# Altium project NeuroPico Hub.PrjPcb (part 1 of 2)
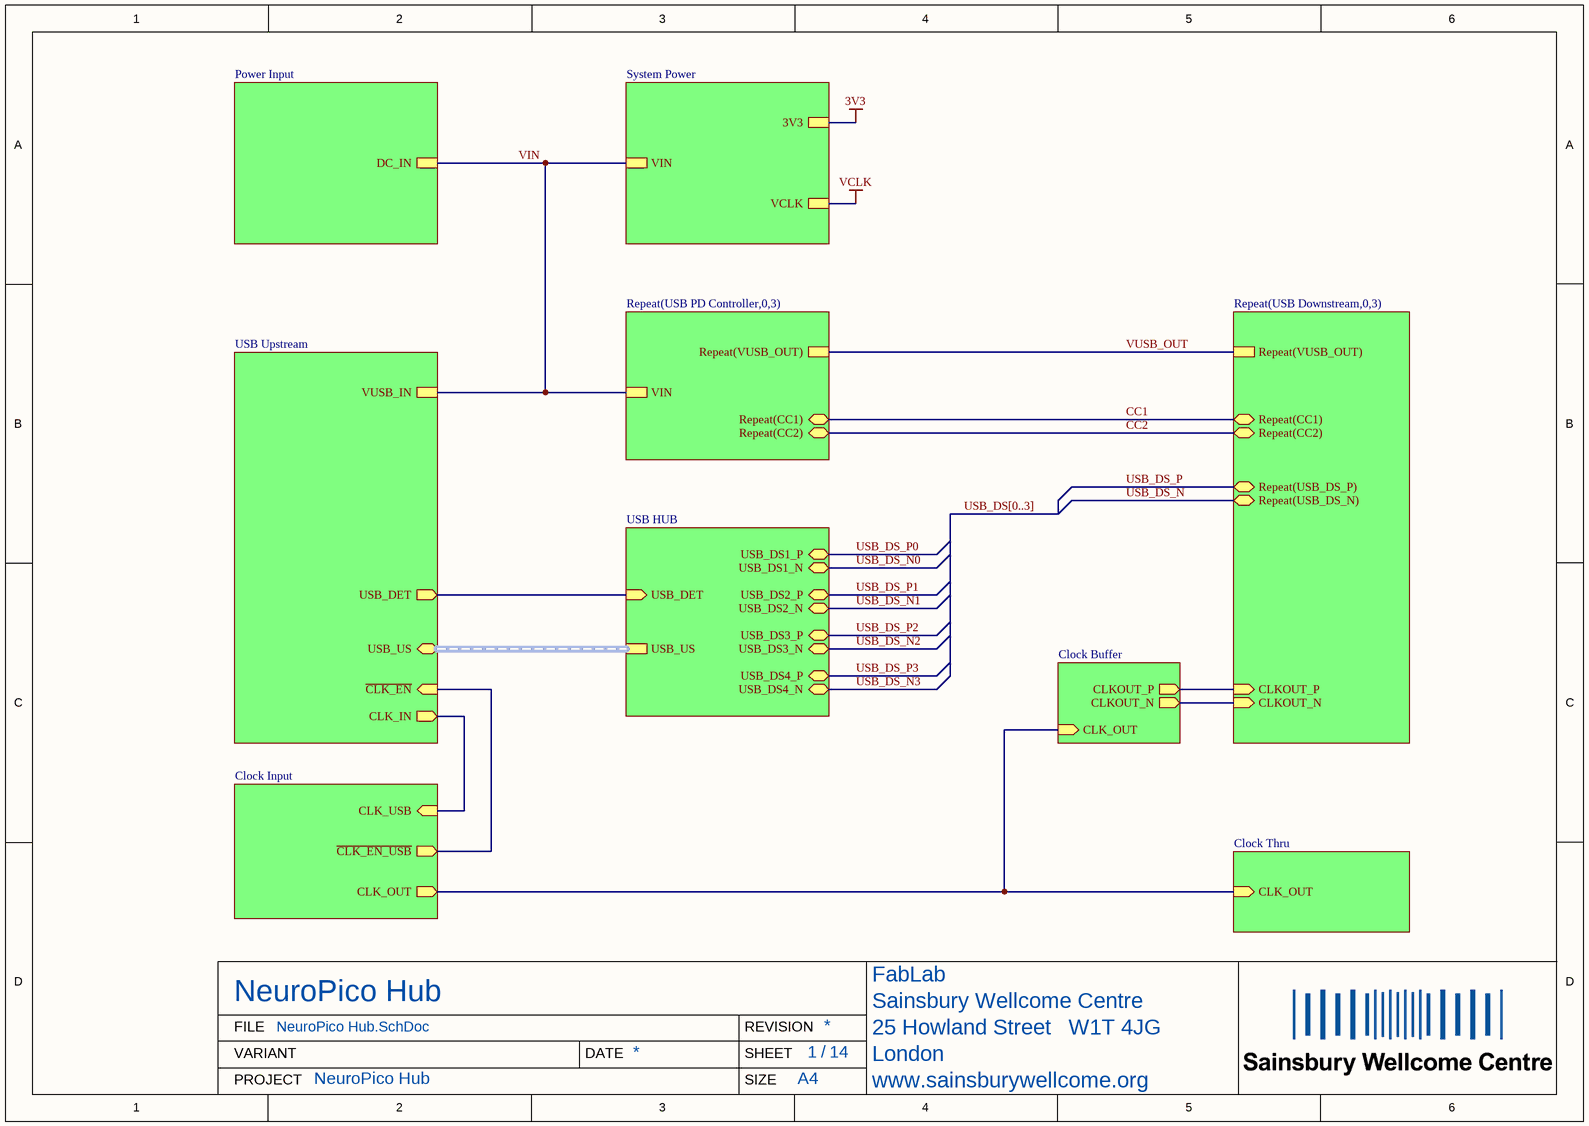
[diagram p0: NeuroPico Hub.SchDoc]
Project: NeuroPico Hub
14 sheets, 397 parts. Net scope: hierarchical (ports join the sheet entries above them; power ports are global).
Board file: NeuroPico Hub.PcbDoc
Sheets:
  NeuroPico Hub.SchDoc
    USB Downstream0 = USB Downstream.SchDoc
    USB Downstream1 = USB Downstream.SchDoc
    USB Downstream2 = USB Downstream.SchDoc
    USB Downstream3 = USB Downstream.SchDoc
    System Power = System Power.SchDoc
    Clock Input = Clock Input.SchDoc
    Power Input = Power Input.SchDoc
    Clock Thru = Clock Thru.SchDoc
    USB Upstream = USB Upstream.SchDoc
      PD Controller Sink = PD Controller Sink.SchDoc
    USB HUB = USB HUB.SchDoc
    USB PD Controller0 = USB PD Controller.SchDoc
      DC SEPIC = DC SEPIC.SchDoc
      PD Controller Source = PD Controller Source.SchDoc
        MOS Switch = MOS Switch.SchDoc
    USB PD Controller1 = USB PD Controller.SchDoc
      DC SEPIC = DC SEPIC.SchDoc
      PD Controller Source = PD Controller Source.SchDoc
        MOS Switch = MOS Switch.SchDoc
    USB PD Controller2 = USB PD Controller.SchDoc
      DC SEPIC = DC SEPIC.SchDoc
      PD Controller Source = PD Controller Source.SchDoc
        MOS Switch = MOS Switch.SchDoc
    USB PD Controller3 = USB PD Controller.SchDoc
      DC SEPIC = DC SEPIC.SchDoc
      PD Controller Source = PD Controller Source.SchDoc
        MOS Switch = MOS Switch.SchDoc
    Clock Buffer = Clock Buffer.SchDoc

## Sheet NeuroPico Hub.SchDoc
size 297 x 209 mm; CompanyName: Sainsbury Wellcome Centre; Organization: FabLab; Address1: Sainsbury Wellcome Centre; Address2: 25 Howland Street; Address3: London; Address4: W1T 4JG; DocumentNumber: 1; SheetNumber: 1; SheetTotal: 14; swcgroup: FabLab; Org: Sainsbury Wellcome Centre; Add1: 25 Howland Street; Add2: London; Add3: W1T 4JG; WebAddress: www.sainsburywellcome.org; SheetSize: A4; SheetName: NeuroPico Hub

### Sub-sheets
Clock Buffer = Clock Buffer.SchDoc: CLK_OUT (in), CLKOUT_P (out), CLKOUT_N (out)
Clock Input = Clock Input.SchDoc: CLK_OUT (out), CLK_USB (in), ~{CLK_EN_USB} (out)
Clock Thru = Clock Thru.SchDoc: CLK_OUT (in)
Power Input = Power Input.SchDoc: DC_IN
Repeat(USB Downstream,0,3) = USB Downstream.SchDoc: CLKOUT_P (in), CLKOUT_N (in), Repeat(USB_DS_P) (bidir), Repeat(USB_DS_N) (bidir), Repeat(CC1) (bidir), Repeat(CC2) (bidir), Repeat(VUSB_OUT)
Repeat(USB PD Controller,0,3) = USB PD Controller.SchDoc: VIN, Repeat(CC1) (bidir), Repeat(CC2) (bidir), Repeat(VUSB_OUT)
System Power = System Power.SchDoc: VIN, 3V3, VCLK
USB HUB = USB HUB.SchDoc: USB_DS1_N (bidir), USB_DS1_P (bidir), USB_DS2_N (bidir), USB_DS2_P (bidir), USB_DS3_P (bidir), USB_DS3_N (bidir), USB_US (harness USB_US), USB_DS4_P (bidir), USB_DS4_N (bidir), USB_DET (in)
USB Upstream = USB Upstream.SchDoc: USB_US (bidir, harness USB_US), VUSB_IN, CLK_IN (out), ~{CLK_EN} (in), USB_DET (out)

### Nets
CC1: sheet Repeat(USB Downstream,0,3)/Repeat(CC1), sheet Repeat(USB PD Controller,0,3)/Repeat(CC1)
CC2: sheet Repeat(USB Downstream,0,3)/Repeat(CC2), sheet Repeat(USB PD Controller,0,3)/Repeat(CC2)
CLK_OUT: sheet Clock Input/CLK_OUT, sheet Clock Thru/CLK_OUT, sheet Clock Buffer/CLK_OUT
CLK_USB: sheet Clock Input/CLK_USB, sheet USB Upstream/CLK_IN
CLKOUT_N: sheet Repeat(USB Downstream,0,3)/CLKOUT_N, sheet Clock Buffer/CLKOUT_N
CLKOUT_P: sheet Repeat(USB Downstream,0,3)/CLKOUT_P, sheet Clock Buffer/CLKOUT_P
USB_DS_N: sheet Repeat(USB Downstream,0,3)/Repeat(USB_DS_N)
USB_DS_P: sheet Repeat(USB Downstream,0,3)/Repeat(USB_DS_P)
VIN: sheet System Power/VIN, sheet Power Input/DC_IN, sheet USB Upstream/VUSB_IN, sheet Repeat(USB PD Controller,0,3)/VIN
VUSB_OUT: sheet Repeat(USB Downstream,0,3)/Repeat(VUSB_OUT), sheet Repeat(USB PD Controller,0,3)/Repeat(VUSB_OUT)
NetQ1_3: sheet Clock Input/~{CLK_EN_USB}, sheet USB Upstream/~{CLK_EN}
NetQ3_3: sheet USB Upstream/USB_DET, sheet USB HUB/USB_DET

### Buses and harness runs
bus USB_DS[0..3]
harness sheet USB HUB/USB_US = sheet USB Upstream/USB_US

### Notes on the sheet
- FILE
- VARIANT
- DATE
- REVISION
- SHEET
- /
- PROJECT
- SIZE

## Sheet USB Downstream.SchDoc
size 297 x 209 mm; CompanyName: Sainsbury Wellcome Centre; Organization: FabLab; Address1: Sainsbury Wellcome Centre; Address2: 25 Howland Street; Address3: London; Address4: W1T 4JG; DocumentNumber: 11; SheetNumber: 11; SheetTotal: 14; swcgroup: FabLab; Org: Sainsbury Wellcome Centre; Add1: 25 Howland Street; Add2: London; Add3: W1T 4JG; WebAddress: www.sainsburywellcome.org; SheetSize: A4; SheetName: USB Downstream
Used 4 times, as channels USB Downstream0, USB Downstream1, USB Downstream2, USB Downstream3. Parts and nets are listed once, with the designators drawn on the sheet.
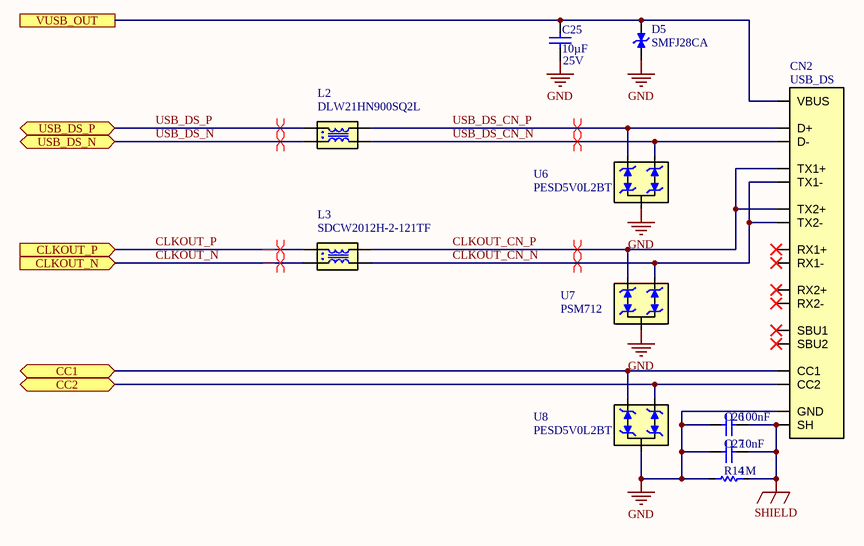
[diagram p1: USB Downstream.SchDoc]

### Parts
C25  value 10µF  Voltage Rating: 25V  [CAP_CHIP_0603]  (hidden comment: C0603-10uF-25V)
C26  value 100nF  [CAP_CHIP_0603]  (hidden comment: C0603-100nF-50V)
C27  value 10nF  [CAP_CHIP_0603]  (hidden comment: C0603-10nF-50V)
CN2  USB_DS  [TYPEC-24P]
D5  SMFJ28CA  [SOD123]
L2  PartNumber: DLW21HN900SQ2L  [IND_CHOKE_0805]  (hidden comment: CHOKE-90R)
L3  PartNumber: SDCW2012H-2-121TF  [IND_CHOKE_0805]  (hidden comment: CHOKE-120R)
R14  value 1M  [RES_CHIP_0603]  (hidden comment: R0603-1M)
U6  PESD5V0L2BT  [SOT23]
U7  PSM712  [SOT23]
U8  PESD5V0L2BT  [SOT23]

### Ports
CC1 (bidir), CC2 (bidir), CLKOUT_N (in), CLKOUT_P (in), USB_DS_N (bidir), USB_DS_P (bidir), VUSB_OUT

### Nets
GND: C25.1 C26.2 C27.2 CN2.A1,_A12,_B1,_B12(GND) D5.1(K) R14.2 U6.3(COM) U7.3(COM) U8.3(COM)
SHIELD: C26.1 C27.1 CN2.0(SH) R14.1
CC1: CN2.A5(CC1) U8.1(ANODE) ; port CC1
CC2: CN2.B5(CC2) U8.2(ANODE) ; port CC2
CLKOUT_CN_N: CN2.A3(TX1-) CN2.B3(TX2-) L3.3 U7.1(ANODE)
CLKOUT_CN_P: CN2.A2(TX1+) CN2.B2(TX2+) L3.2 U7.2(ANODE)
CLKOUT_N: L3.4 ; port CLKOUT_N
CLKOUT_P: L3.1 ; port CLKOUT_P
USB_DS_CN_N: CN2.A7,_B7(D-) L2.3 U6.1(ANODE)
USB_DS_CN_P: CN2.A6,_B6(D+) L2.2 U6.2(ANODE)
USB_DS_N: L2.4 ; port USB_DS_N
USB_DS_P: L2.1 ; port USB_DS_P
VUSB_OUT: C25.2 CN2.A4,_A9,_B4,_B9(VBUS) D5.2(A) ; port VUSB_OUT

Not connected (* = marked no-connect by the designer): CN2 A8(SBU1)* A10(RX2-)* A11(RX2+)* B8(SBU2)* B10(RX1-)* B11(RX1+)*

### Channels
USB Downstream0: designators end in A; ports CC1=CC10 CC2=CC20 CLKOUT_N=CLKOUT_N CLKOUT_P=CLKOUT_P USB_DS_N=USB_DS1_N USB_DS_P=USB_DS1_P VUSB_OUT=VUSB_OUT0
USB Downstream1: designators end in B; ports CC1=CC11 CC2=CC21 CLKOUT_N=CLKOUT_N CLKOUT_P=CLKOUT_P USB_DS_N=USB_DS2_N USB_DS_P=USB_DS2_P VUSB_OUT=VUSB_OUT1
USB Downstream2: designators end in C; ports CC1=CC12 CC2=CC22 CLKOUT_N=CLKOUT_N CLKOUT_P=CLKOUT_P USB_DS_N=USB_DS3_N USB_DS_P=USB_DS3_P VUSB_OUT=VUSB_OUT2
USB Downstream3: designators end in D; ports CC1=CC13 CC2=CC23 CLKOUT_N=CLKOUT_N CLKOUT_P=CLKOUT_P USB_DS_N=USB_DS4_N USB_DS_P=USB_DS4_P VUSB_OUT=VUSB_OUT3

### Layout directives
differential pair; differential pair class USB: USB_DS1_N, USB_DS1_P, USB_DS_CN_N_USB Downstream0, USB_DS_CN_P_USB Downstream0
differential pair; differential pair class RS485: CLKOUT_CN_N_USB Downstream0, CLKOUT_CN_P_USB Downstream0, CLKOUT_N, CLKOUT_P

### Notes on the sheet
- FILE
- VARIANT
- DATE
- REVISION
- SHEET
- /
- PROJECT
- SIZE

### Library data of the parts
C25 = CMP-611-0050-6: 0603 Multilayer Ceramic Capacitors MLCC; PartNumber: CL10A106MA8NRNC; Dielectric: X5R; Pick&PlaceFootprint: C0603; Tolerance: 20%; Case/Package: 0603; LCSC Part N.: C96446; RoHS: Yes; Capacitor Type: Ceramic; Mount: SMD
C26 = CMP-611-0027-24: 0603 Multilayer Ceramic Capacitors MLCC; PartNumber: CC0603KRX7R9BB104; Voltage Rating: 50V; Pick&PlaceFootprint: C0603; Dielectric: X7R; Tolerance: 10%; LCSC Part N.: C14663; Capacitor Type: Ceramic; Case/Package: 0603; RoHS: Yes; Mount: SMD
C27 = CMP-611-0022-7: 0603 Multilayer Ceramic Capacitors MLCC; PartNumber: 0603B103K500NT; Tolerance: 10%; Voltage Rating: 50V; Dielectric: X7R; Pick&PlaceFootprint: C0603; Capacitor Type: Ceramic; Mount: SMD; Case/Package: 0603; LCSC Part N.: C57112; RoHS: Yes
CN2 = CMP-340-0003-10: USB 3.1 5A 1 260℃ Surface Mount，Right Angle 24P Female -45℃~+85℃ Type-C SMD USB Connectors; pin to pad: S1>G1+G2+G3+G4+G5+G6; PartNumber: TYPEC-324G-BCP24; Current Rating: 5A; Mount: Surface Mount; LCSC Part N.: C920230; Orientation: Horizontal; Gender: Female
D5 = CMP-210-0002-1: 4.4A 45.4V@4.4A 200W 31.1V Bi-Directional 28V SOD-123F Electrostatic and Surge Protection (TVS/ESD); Breakdown Voltage: 31V; Clamp Voltage: 45.4V; PartNumber: SMFJ28CA; Stand-off Voltage: 28V; Pick&PlaceFootprint: SOD-123; Mount: Surface Mount; LCSC Part N.: C5125651
L2 = CMP-600-0002-3: Data Line Filter, 2 Function(s), 50V, 0.33A, 4 Pin(s); DC Resistance-Max: 350mR; Insulation Resistance-Min: 10MR; Current Rating: 330mA; Output Impedance: 90R; Channels: 2; LCSC Part N.: C80529; Voltage Rating: 50V
L3 = CMP-600-0007-1: Data Line Filter, 2 Function(s), 20V, 0.28A, 4 Pin(s); Output Impedance: 120R; Current Rating: 280mA; DC Resistance-Max: 400mR; Insulation Resistance-Min: 10kR; Channels: 2; LCSC Part N.: C370248; Voltage Rating: 20V
R14 = CMP-633-0066-20: 100mW Thick Film Resistors 75V ±100ppm/℃ ±1% 0603 Chip Resistor; PartNumber: 0603WAF1004T5E; Pick&PlaceFootprint: R0603; Number of Resistors: 1; Mount: Surface Mount; Case/Package: 0603; Voltage Rating: 75V; LCSC Part N.: C22935; Power Rating: 100mW; Tolerance: 1%
U6 U8 = CMP-210-0005-2: Low capacitance double bidirectional ESD protection diodes in SOT23; Pick&PlaceFootprint: SOT-23; Stand-off Voltage: 5V; Breakdown Voltage: 7.5V; Clamp Voltage: 10V; PartNumber: PESD5V0L2BT; LCSC Part N.: C2858724
U7 = CMP-210-0000-4: 19V 13.3V 12V SOT-23 Electrostatic and Surge Protection (TVS/ESD); PartNumber: PSM712-LF-T7; LCSC Part N.: C32677; Stand-off Voltage: 12V; Pick&PlaceFootprint: SOT-23; Breakdown Voltage: 13.3V; Clamp Voltage: 19V; Mount: Surface Mount

## Sheet System Power.SchDoc
size 297 x 209 mm; CompanyName: Sainsbury Wellcome Centre; Organization: FabLab; Address1: Sainsbury Wellcome Centre; Address2: 25 Howland Street; Address3: London; Address4: W1T 4JG; DocumentNumber: 3; SheetNumber: 3; SheetTotal: 14; swcgroup: FabLab; Org: Sainsbury Wellcome Centre; Add1: 25 Howland Street; Add2: London; Add3: W1T 4JG; WebAddress: www.sainsburywellcome.org; SheetSize: A4; SheetName: System Power
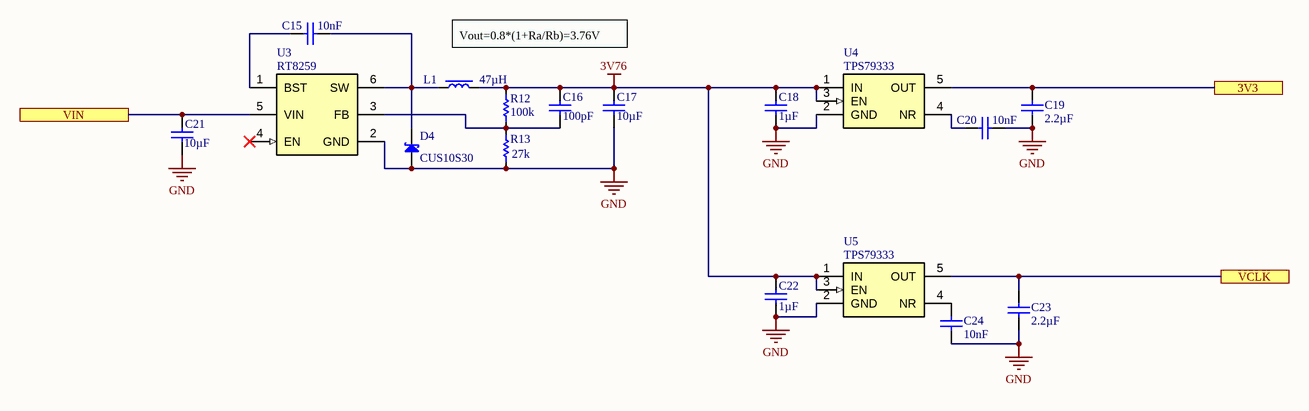
[diagram p2: System Power.SchDoc]

### Parts
C15  value 10nF  [CAP_CHIP_0603]  (hidden comment: C0603-10nF-50V)
C16  value 100pF  [CAP_CHIP_0603]  (hidden comment: C0603-100pF-50V)
C17  value 10µF  [CAP_CHIP_0603]  (hidden comment: C0603-10uF-35V)
C18  value 1µF  [CAP_CHIP_0603]  (hidden comment: C0603-1uF-50V)
C19  value 2.2µF  [CAP_CHIP_0603]  (hidden comment: C0603-2.2uF-50V)
C20  value 10nF  [CAP_CHIP_0603]  (hidden comment: C0603-10nF-100V)
C21  value 10µF  [CAP_CHIP_0603]  (hidden comment: C0603-10uF-35V)
C22  value 1µF  [CAP_CHIP_0603]  (hidden comment: C0603-1uF-50V)
C23  value 2.2µF  [CAP_CHIP_0603]  (hidden comment: C0603-2.2uF-50V)
C24  value 10nF  [CAP_CHIP_0603]  (hidden comment: C0603-10nF-100V)
D4  CUS10S30  [SOD323]
L1  value 47µH  [IND_PWR_1210]  (hidden comment: L-PWR-47uH-0.3A)
R12  value 100k  [RES_CHIP_0603]  (hidden comment: R0603-100K)
R13  value 27k  [RES_CHIP_0603]  (hidden comment: R0603-27K)
U3  RT8259  [SOT23-6]
U4  TPS79333  [SOT23-5]
U5  TPS79333  [SOT23-5]

### Ports
3V3, VCLK, VIN

### Nets
3V3: C19.2 U4.5(OUT) ; port 3V3
3V76: C16.2 C17.2 C18.2 C22.2 L1.2 R12.2 U4.1(IN) U4.3(EN) U5.1(IN) U5.3(EN)
GND: C17.1 C18.1 C19.1 C20.1 C21.1 C22.1 C23.1 C24.1 D4.2(A) R13.1 U3.2(GND) U4.2(GND) U5.2(GND)
VCLK: C23.2 U5.5(OUT) ; port VCLK
VIN: C21.2 U3.5(VIN) ; port VIN
NetC15_1: C15.1 D4.1(C) L1.1 U3.6(SW)
NetC15_2: C15.2 U3.1(BST)
NetC16_1: C16.1 R12.1 R13.2 U3.3(FB)
NetC20_2: C20.2 U4.4(NR)
NetC24_2: C24.2 U5.4(NR)

Not connected (* = marked no-connect by the designer): U3 4(EN)*

### Notes on the sheet
- Vout=0.8*(1+Ra/Rb)=3.76V
- FILE
- VARIANT
- DATE
- REVISION
- SHEET
- /
- PROJECT
- SIZE

### Library data of the parts
C15 = CMP-611-0022-7: 0603 Multilayer Ceramic Capacitors MLCC; PartNumber: 0603B103K500NT; Tolerance: 10%; Voltage Rating: 50V; Pick&PlaceFootprint: C0603; Dielectric: X7R; RoHS: Yes; Capacitor Type: Ceramic; Mount: SMD; Case/Package: 0603; LCSC Part N.: C57112
C16 = CMP-611-0038-6: 0603 Multilayer Ceramic Capacitors MLCC; PartNumber: CL10C101JB8NNNC; Pick&PlaceFootprint: C0603; Tolerance: 5%; Voltage Rating: 50V; Dielectric: C0G; Case/Package: 0603; LCSC Part N.: C14858; Capacitor Type: Ceramic; Mount: SMD; RoHS: Yes
C17 C21 = CMP-611-0048-3: Ceramic Capacitor, Multilayer, Ceramic, 35V, 20% +Tol, 20% -Tol, X5R, 15% TC, 10uF, Surface Mount, 0603; PartNumber: GRM188R6YA106MA73D; Pick&PlaceFootprint: C0603; Dielectric: X5R; Capacitor Type: Ceramic; Mount: SMD; LCSC Part N.: C194427; RoHS: Yes; Tolerance: 20%; Voltage Rating: 35V; Case/Package: 0603
C18 C22 = CMP-611-0033-11: 0603 Multilayer Ceramic Capacitors MLCC; PartNumber: CL10A105KB8NNNC; Pick&PlaceFootprint: C0603; Voltage Rating: 50V; Dielectric: X5R; Tolerance: 10%; Case/Package: 0603; LCSC Part N.: C15849; RoHS: Yes; Mount: SMD; Capacitor Type: Ceramic
C19 C23 = CMP-611-0060-3: 0603 Multilayer Ceramic Capacitors MLCC; PartNumber: GRM188R61H225KE11D; Pick&PlaceFootprint: C0603; Voltage Rating: 50V; Dielectric: X5R; Tolerance: 10%; Mount: SMD; LCSC Part N.: C162273; Capacitor Type: Ceramic; Case/Package: 0603; RoHS: Yes
C20 C24 = CMP-611-0030-11: 0603 Multilayer Ceramic Capacitors MLCC; PartNumber: CL10B103KC84PEL; Tolerance: 10%; Voltage Rating: 100V; Dielectric: X7R; Pick&PlaceFootprint: C0603; LCSC Part N.: C525730; Case/Package: 0603; Capacitor Type: Ceramic; Mount: SMD; RoHS: Yes
D4 = CMP-821-0013-3: Rectifier Diode, Schottky, 1 Phase, 1 Element, 1A, 30V V(RRM), Silicon; PartNumber: CUS10S30,H3F; Forward Voltage: 370mV; LCSC Part N.: C146335; Max Reverse Voltage: 30V; Mount: Surface Mount; Pick&PlaceFootprint: SOD323; Forward Current: 1A
L1 = CMP-620-0005-6: Inductor Power Chip Shielded Wirewound 47uH 20% 1MHz Ferrite 0.5A 0.9Ohm DCR 1210 Automotive T/R; PartNumber: LQW32FT470M0HL; RMS Current (Irms): 500mA; Saturation Current: 300mA; DC Resistance (DCR): 900mR; Tolerance: 20%; LCSC Part N.: C907956
R12 = CMP-633-0000-28: 100mW Thick Film Resistors 75V ±100ppm/℃ ±1% 0603 Chip Resistor; PartNumber: 0603WAF1003T5E; Number of Resistors: 1; Pick&PlaceFootprint: R0603; LCSC Part N.: C25803; Mount: Surface Mount; Voltage Rating: 75V; Power Rating: 100mW; Case/Package: 0603; Tolerance: 1%
R13 = CMP-633-0124-2: 100mW Thick Film Resistors 75V ±100ppm/℃ ±1% 0603 Chip Resistor; PartNumber: 0603WAF2702T5E; Pick&PlaceFootprint: R0603; Number of Resistors: 1; Tolerance: 1%; Case/Package: 0603; Mount: Surface Mount; Voltage Rating: 75V; Power Rating: 100mW; LCSC Part N.: C22967
U3 = CMP-970-0044-2: Step-down type Adjustable 800mV~15V 1.2A 4.5V~24V Switching Regulator/Controller; PartNumber: RT8259GJ6; Min Input Voltage: 4.5V; RDS(On): 300mR; Reference Voltage: 0.8V; Switcher Configuration: BUCK; Switching Frequency: 1.4MHz; Max Input Voltage: 24V; Max Output Voltage: 15V; LCSC Part N.: C425775; Pick&PlaceFootprint: SOT23-6; Max Output current: 1.2A
U4 U5 = CMP-970-0017-6: LDO Regulator Pos 3.3V 0.2A 5-Pin SOT-23-5 200mA; PartNumber: TPS79333DBVR; Max Input Voltage: 5.5V; Dropout Voltage: 102mV; Line Regulation: 0.05%; Quiescent Current: 170uA; PSRR: 70dB; Output Noise: 32uV; Accuracy: 2%; Output Type: Fixed; Load Regulation: 0.03%; LCSC Part N.: C9840; Pick&PlaceFootprint: SOT23-5; Output Voltage: 3.3V; Max Output Current: 200mA

## Sheet Clock Input.SchDoc
size 297 x 209 mm; CompanyName: Sainsbury Wellcome Centre; Organization: FabLab; Address1: Sainsbury Wellcome Centre; Address2: 25 Howland Street; Address3: London; Address4: W1T 4JG; DocumentNumber: 12; SheetNumber: 12; SheetTotal: 14; swcgroup: FabLab; Org: Sainsbury Wellcome Centre; Add1: 25 Howland Street; Add2: London; Add3: W1T 4JG; WebAddress: www.sainsburywellcome.org; SheetSize: A4; SheetName: Clock Input
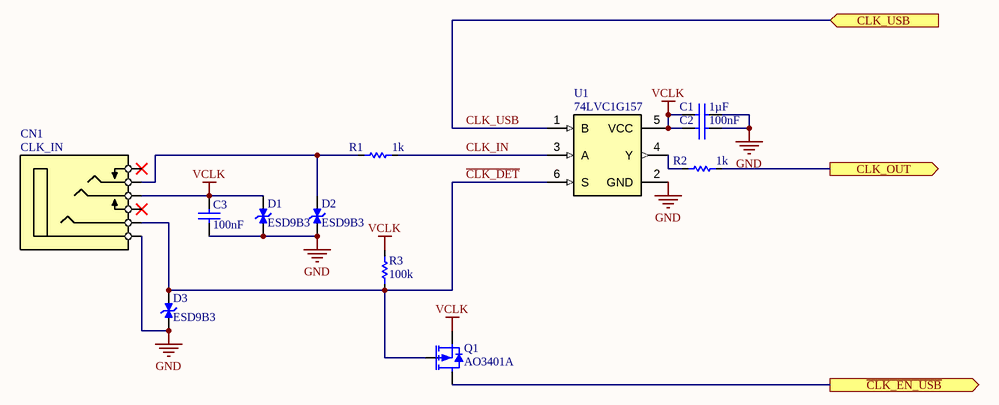
[diagram p3: Clock Input.SchDoc]

### Parts
C1  value 1µF  [CAP_CHIP_0603]  (hidden comment: C0603-1uF-50V)
C2  value 100nF  [CAP_CHIP_0603]  (hidden comment: C0603-100nF-50V)
C3  value 100nF  [CAP_CHIP_0603]  (hidden comment: C0603-100nF-50V)
CN1  CLK_IN  [PJ-316A]
D1  ESD9B3  [SOD923]
D2  ESD9B3  [SOD923]
D3  ESD9B3  [SOD923]
Q1  AO3401A  [SOT23]
R1  value 1k  [RES_CHIP_0603]  (hidden comment: R0603-1K)
R2  value 1k  [RES_CHIP_0603]  (hidden comment: R0603-1K)
R3  value 100k  [RES_CHIP_0603]  (hidden comment: R0603-100K)
U1  74LVC1G157  [SOT363]

### Ports
CLK_OUT (out), CLK_USB (in), ~{CLK_EN_USB} (out)

### Nets
GND: C1.1 C2.1 C3.1 CN1.1(S) D1.1(K) D2.1(K) D3.1(K) U1.2(GND)
VCLK: C1.2 C2.2 C3.2 CN1.3(R) D1.2(A) Q1.2(S) R3.2 U1.5(VCC)
~{CLK_DET}: CN1.4(RR) D3.2(A) Q1.1(G) R3.1 U1.6(S)
CLK_IN: R1.1 U1.3(A)
CLK_OUT: R2.1 ; port CLK_OUT
CLK_USB: U1.1(B) ; port CLK_USB
NetCN1_2: CN1.2(T) D2.2(A) R1.2
NetQ1_3: Q1.3(D) ; port ~{CLK_EN_USB}
NetR2_2: R2.2 U1.4(Y)

Not connected (* = marked no-connect by the designer): CN1 5(TS)* 6(RS)*

### Notes on the sheet
- FILE
- VARIANT
- DATE
- REVISION
- SHEET
- /
- PROJECT
- SIZE

### Library data of the parts
C1 = CMP-611-0033-11: as C18 on sheet System Power; Case/Package: 0603; LCSC Part N.: C15849; RoHS: Yes; Mount: SMD; Capacitor Type: Ceramic
C2 = CMP-611-0027-24: 0603 Multilayer Ceramic Capacitors MLCC; PartNumber: CC0603KRX7R9BB104; Tolerance: 10%; Pick&PlaceFootprint: C0603; Dielectric: X7R; Voltage Rating: 50V; Capacitor Type: Ceramic; RoHS: Yes; Mount: SMD; LCSC Part N.: C14663; Case/Package: 0603
C3 = CMP-611-0027-24: as C26 on sheet USB Downstream; LCSC Part N.: C14663; Capacitor Type: Ceramic; Case/Package: 0603; RoHS: Yes; Mount: SMD
CN1 = CMP-380-0019-5: 3.5mm headphone jack 235℃ 30V 500mA SMD Audio Connector; PartNumber: PJ-316A-6A; Gender: Female; IEC Conformance: No; Mount: Through Hole; LCSC Part N.: C128987; Orientation: Horizontal; Pitch: 3.5mm
D1-D3 = CMP-210-0004-2: ESD9B3.3ST5G, Bi-Directional TVS Diode, 300mW, 2-Pin SOD-923; Stand-off Voltage: 3.3V; Pick&PlaceFootprint: SOT-23; Breakdown Voltage: 5V; Clamp Voltage: 11.5V; LCSC Part N.: C96512; PartNumber: ESD9B3.3ST5G
Q1 = CMP-810-0003-2: 30V 4A 44mΩ@10V,4.3A 1.4W 1.3V@250uA 1 PChannel SOT-23-3L MOSFETs; RDS(ON): 44mR; Gate-Source Voltage (Vgs): 12V; Pick&PlaceFootprint: SOT-23; Drain Current (Id): -4A; Switching Time: 60ns; Drain-Source Voltage (Vds): -30V; Polarity: P Channel; Power Dissipation: 1.4W; LCSC Part N.: C15127; Mount: Surface Mount; PartNumber: AO3401A
R1 R2 = CMP-633-0013-26: 100mW Thick Film Resistors 75V ±100ppm/℃ ±1% 0603 Chip Resistor; PartNumber: 0603WAF1001T5E; Pick&PlaceFootprint: R0603; Number of Resistors: 1; Voltage Rating: 75V; Mount: Surface Mount; Case/Package: 0603; LCSC Part N.: C21190; Tolerance: 1%; Power Rating: 100mW
R3 = CMP-633-0000-28: as R12 on sheet System Power; LCSC Part N.: C25803; Mount: Surface Mount; Voltage Rating: 75V; Power Rating: 100mW; Case/Package: 0603; Tolerance: 1%
U1 = CMP-9A0-0002-3: Encoders, Decoders, Multiplexers & Demultiplexers 74LVC1G157GV-Q100/SC-74/REEL 7; Min Supply Voltage: 1.65V; Max Supply Voltage: 5.5V; Max Output current: 32mA; LCSC Part N.: C135822; PartNumber: 74LVC1G157GV

## Sheet Power Input.SchDoc
size 297 x 209 mm; CompanyName: Sainsbury Wellcome Centre; Organization: FabLab; Address1: Sainsbury Wellcome Centre; Address2: 25 Howland Street; Address3: London; Address4: W1T 4JG; DocumentNumber: 2; SheetNumber: 2; SheetTotal: 14; swcgroup: FabLab; Org: Sainsbury Wellcome Centre; Add1: 25 Howland Street; Add2: London; Add3: W1T 4JG; WebAddress: www.sainsburywellcome.org; SheetSize: A4; SheetName: Power Input
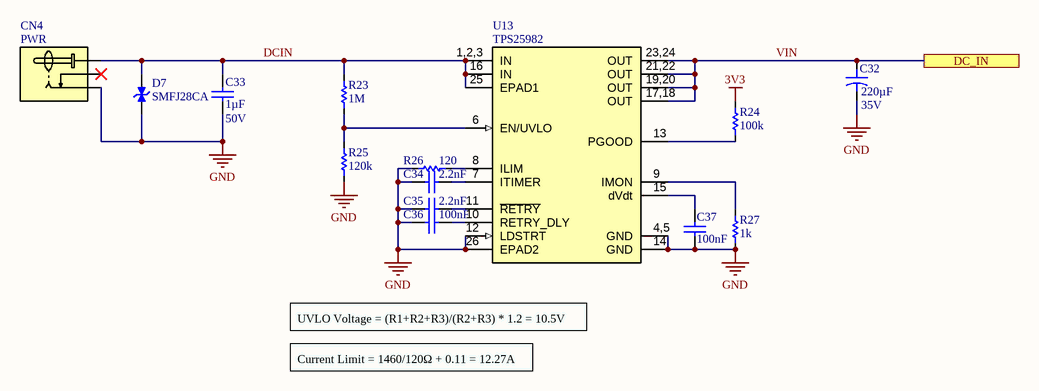
[diagram p4: Power Input.SchDoc]

### Parts
C32  value 220µF  Voltage Rating: 35V  [ECAP_SMD_D8_10.2L]  (hidden comment: SC8-220uF-35V)
C33  value 1µF  Voltage Rating: 50V  [CAP_CHIP_0603]  (hidden comment: C0603-1uF-50V)
C34  value 2.2nF  [CAP_CHIP_0603]  (hidden comment: C0603-2.2nF-50V)
C35  value 2.2nF  [CAP_CHIP_0603]  (hidden comment: C0603-2.2nF-50V)
C36  value 100nF  [CAP_CHIP_0603]  (hidden comment: C0603-100nF-50V)
C37  value 100nF  [CAP_CHIP_0603]  (hidden comment: C0603-100nF-50V)
CN4  PWR  [DC-005-2.0]
D7  SMFJ28CA  [SOD123]
R23  value 1M  [RES_CHIP_0603]  (hidden comment: R0603-1M)
R24  value 100k  [RES_CHIP_0603]  (hidden comment: R0603-100K)
R25  value 120k  [RES_CHIP_0603]  (hidden comment: R0603-120K)
R26  value 120  [RES_CHIP_0603]  (hidden comment: R0603-120R)
R27  value 1k  [RES_CHIP_0603]  (hidden comment: R0603-1K)
U13  TPS25982  [VQFN24]

### Ports
DC_IN

### Nets
3V3: R24.2
GND: C32.2 C33.1 C34.2 C35.2 C36.2 C37.1 CN4.2(Ring) D7.1(K) R25.1 R26.2 R27.1 U13.4,5(GND) U13.12(LDSTRT) U13.14(GND) U13.26(EPAD2)
DCIN: C33.2 CN4.1(Center) D7.2(A) R23.2 U13.1,2,3(IN) U13.16(IN) U13.25(EPAD1)
VIN: C32.1 U13.17,18(OUT) U13.19,20(OUT) U13.21,22(OUT) U13.23,24(OUT) ; port DC_IN
NetC34_1: C34.1 U13.7(ITIMER)
NetC35_1: C35.1 U13.11(~{RETRY})
NetC36_1: C36.1 U13.10(RETRY_DLY)
NetC37_2: C37.2 U13.15(dVdt)
NetR23_1: R23.1 R25.2 U13.6(EN/UVLO)
NetR24_1: R24.1 U13.13(PGOOD)
NetR26_1: R26.1 U13.8(ILIM)
NetR27_2: R27.2 U13.9(IMON)

Not connected (* = marked no-connect by the designer): CN4 3(Detect)*

### Notes on the sheet
- UVLO Voltage = (R1+R2+R3)/(R2+R3) * 1.2 = 10.5V
- Current Limit = 1460/120Ω + 0.11 = 12.27A
- FILE
- VARIANT
- DATE
- REVISION
- SHEET
- /
- PROJECT
- SIZE

### Library data of the parts
C32 = CMP-612-0005-5: Cap Aluminum Polymer 220uF 35V 20% Cylindrical 27m Ohm 2000mA 4000 hr 125°C Emboss T/R; PartNumber: EEHZK1V221UP; Pick&PlaceFootprint: EC8; ESR (Equivalent Series Resistance): 17mR; Capacitor Type: Solid; Ripple Current: 2A; LCSC Part N.: C454287; Mount: Surface Mount; Height: 10.5mm; Tolerance: 20%
C33 = CMP-611-0033-11: 0603 Multilayer Ceramic Capacitors MLCC; PartNumber: CL10A105KB8NNNC; Pick&PlaceFootprint: C0603; Dielectric: X5R; Tolerance: 10%; Case/Package: 0603; LCSC Part N.: C15849; RoHS: Yes; Mount: SMD; Capacitor Type: Ceramic
C34 C35 = CMP-611-0074-1: 0603 Multilayer Ceramic Capacitors MLCC; PartNumber: 0603B222K500NT; Voltage Rating: 50V; Pick&PlaceFootprint: C0603; Tolerance: 10%; Dielectric: X7R; Case/Package: 0603; RoHS: Yes; Mount: SMD; Capacitor Type: Ceramic; LCSC Part N.: C1604
C36 C37 = CMP-611-0027-24: as C2 on sheet Clock Input; Capacitor Type: Ceramic; RoHS: Yes; Mount: SMD; LCSC Part N.: C14663; Case/Package: 0603
CN4 = CMP-360-0005-6: Surface Mount, Right Angle 2.5A 24V SMD DC Power Connector; PartNumber: DC-005-2.5A-2.0-SMT; Connector Type: Jack,Power; Pitch: 2.0mm; Gender: Male; Contact Plating: Tin; Voltage Rating: 24V; Contact Material: Copper Alloy; Current Rating: 2.5A; Mount: Surface Mount; LCSC Part N.: C2880543; Orientation: Horizontal
D7 = CMP-210-0002-1: as D5 on sheet USB Downstream; PartNumber: SMFJ28CA; Stand-off Voltage: 28V; Pick&PlaceFootprint: SOD-123; Mount: Surface Mount; LCSC Part N.: C5125651
R23 = CMP-633-0066-20: 100mW Thick Film Resistors 75V ±100ppm/℃ ±1% 0603 Chip Resistor; PartNumber: 0603WAF1004T5E; Number of Resistors: 1; Pick&PlaceFootprint: R0603; Voltage Rating: 75V; Mount: Surface Mount; LCSC Part N.: C22935; Power Rating: 100mW; Tolerance: 1%; Case/Package: 0603
R24 = CMP-633-0000-28: as R12 on sheet System Power; LCSC Part N.: C25803; Mount: Surface Mount; Voltage Rating: 75V; Power Rating: 100mW; Case/Package: 0603; Tolerance: 1%
R25 = CMP-633-0146-1: 100mW Thick Film Resistors 75V ±100ppm/℃ ±1% 0603 Chip Resistor; PartNumber: 0603WAF1203T5E; Number of Resistors: 1; Pick&PlaceFootprint: R0603; Voltage Rating: 75V; Mount: Surface Mount; Tolerance: 1%; LCSC Part N.: C25808; Power Rating: 100mW; Case/Package: 0603
R26 = CMP-633-0100-12: 100mW Thick Film Resistors 75V ±100ppm/℃ ±1% 0603 Chip Resistor; PartNumber: 0603WAF1200T5E; Pick&PlaceFootprint: R0603; Number of Resistors: 1; Mount: Surface Mount; Tolerance: 1%; Voltage Rating: 75V; Case/Package: 0603; Power Rating: 100mW; LCSC Part N.: C22787
R27 = CMP-633-0013-26: as R1 on sheet Clock Input; Voltage Rating: 75V; Case/Package: 0603; Tolerance: 1%; Mount: Surface Mount; LCSC Part N.: C21190; Power Rating: 100mW
U13 = CMP-970-0065-3: Smart Electronic Fuse with Accurate Load Current Monitor 2.7mOhm 15A 2.7V to 24V 24-Pin VQFN T/R; PartNumber: TPS259827ONRGET; RdsOn: 2.7mR; Accuracy: 1.5%; Min Vin: 2.7V; Output Current: 15A; LCSC Part N.: C2155765; Max Vin: 24V

## Sheet Clock Thru.SchDoc
size 297 x 209 mm; CompanyName: Sainsbury Wellcome Centre; Organization: FabLab; Address1: Sainsbury Wellcome Centre; Address2: 25 Howland Street; Address3: London; Address4: W1T 4JG; DocumentNumber: 14; SheetNumber: 14; SheetTotal: 14; swcgroup: FabLab; Org: Sainsbury Wellcome Centre; Add1: 25 Howland Street; Add2: London; Add3: W1T 4JG; WebAddress: www.sainsburywellcome.org; SheetSize: A4; SheetName: Clock Thru
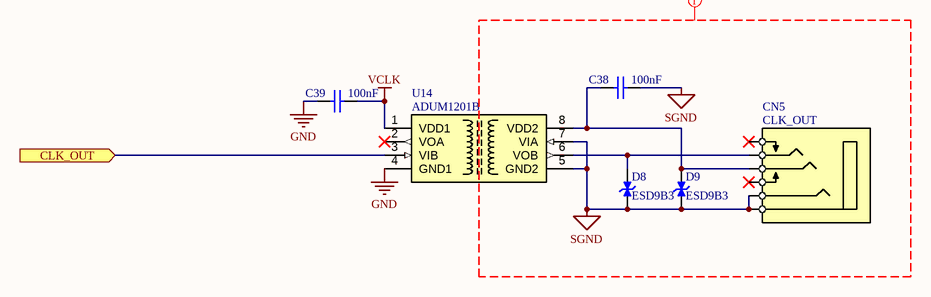
[diagram p5: Clock Thru.SchDoc]

### Parts
C38  value 100nF  [CAP_CHIP_0603]  (hidden comment: C0603-100nF-50V)
C39  value 100nF  [CAP_CHIP_0603]  (hidden comment: C0603-100nF-50V)
CN5  CLK_OUT  [PJ-316A]
D8  ESD9B3  [SOD923]
D9  ESD9B3  [SOD923]
U14  ADUM1201B  [SOIC8]

### Ports
CLK_OUT (in)

### Nets
GND: C39.2 U14.4(GND1)
SGND: C38.1 CN5.1(S) CN5.4(RR) D8.1(K) D9.1(K) U14.5(GND2) U14.7(VIA)
VCLK: C39.1 U14.1(VDD1)
CLK_OUT: U14.3(VIB) ; port CLK_OUT
NetC38_2: C38.2 CN5.3(R) D9.2(A) U14.8(VDD2)
NetCN5_2: CN5.2(T) D8.2(A) U14.6(VOB)

Not connected (* = marked no-connect by the designer): CN5 5(TS)* 6(RS)*; U14 2(VOA)*

### Layout directives
mark named Isolated Output: SGND

### Notes on the sheet
- FILE
- VARIANT
- DATE
- REVISION
- SHEET
- /
- PROJECT
- SIZE

### Library data of the parts
C38 C39 = CMP-611-0027-24: as C26 on sheet USB Downstream; LCSC Part N.: C14663; Capacitor Type: Ceramic; Case/Package: 0603; RoHS: Yes; Mount: SMD
CN5 = CMP-380-0019-5: as CN1 on sheet Clock Input; Mount: Through Hole; LCSC Part N.: C128987; Orientation: Horizontal; Pitch: 3.5mm
D8 D9 = CMP-210-0004-2: as D1 on sheet Clock Input; LCSC Part N.: C96512; PartNumber: ESD9B3.3ST5G
U14 = CMP-930-0008-4: General Purpose Digital Isolator 2500Vrms 2 Channel 10Mbps 25kV/µs CMTI 8-SOIC (0.154; PartNumber: ADUM1201BRZ-RL7; Min Supply Voltage: 2.7V; Max Supply Voltage: 5.5V; Data Rate: 25Mbps; Pick&PlaceFootprint: SOIC8; LCSC Part N.: C87626

## Sheet USB Upstream.SchDoc
size 297 x 209 mm; CompanyName: Sainsbury Wellcome Centre; Organization: FabLab; Address1: Sainsbury Wellcome Centre; Address2: 25 Howland Street; Address3: London; Address4: W1T 4JG; DocumentNumber: 4; SheetNumber: 4; SheetTotal: 14; swcgroup: FabLab; Org: Sainsbury Wellcome Centre; Add1: 25 Howland Street; Add2: London; Add3: W1T 4JG; WebAddress: www.sainsburywellcome.org; SheetSize: A4; SheetName: USB Upstream
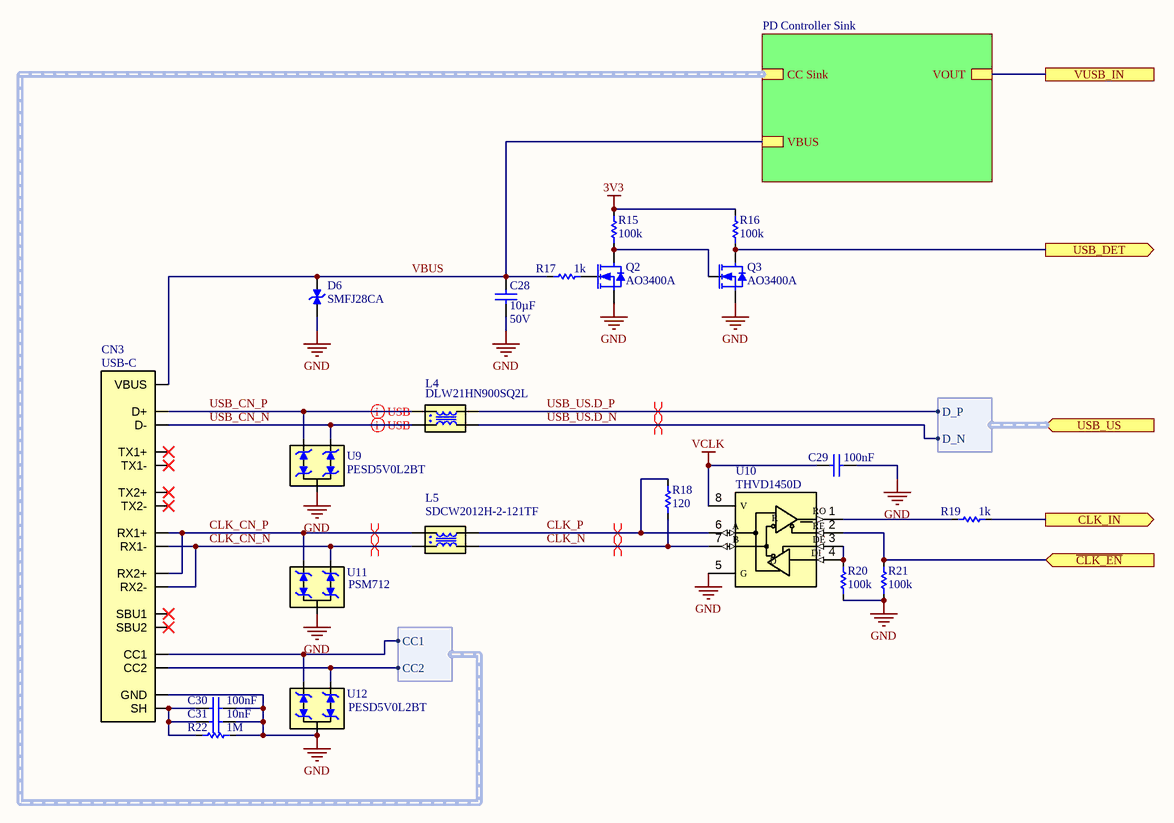
[diagram p6: USB Upstream.SchDoc]

### Parts
C28  value 10µF  Voltage Rating: 50V  [CAP_CHIP_0805]  (hidden comment: C0805-10uF-50V)
C29  value 100nF  [CAP_CHIP_0603]  (hidden comment: C0603-100nF-50V)
C30  value 100nF  [CAP_CHIP_0603]  (hidden comment: C0603-100nF-50V)
C31  value 10nF  [CAP_CHIP_0603]  (hidden comment: C0603-10nF-50V)
CN3  USB-C  [TYPEC-24P]
D6  SMFJ28CA  [SOD123]
L4  PartNumber: DLW21HN900SQ2L  [IND_CHOKE_0805]  (hidden comment: CHOKE-90R)
L5  PartNumber: SDCW2012H-2-121TF  [IND_CHOKE_0805]  (hidden comment: CHOKE-120R)
Q2  AO3400A  [SOT23]
Q3  AO3400A  [SOT23]
R15  value 100k  [RES_CHIP_0603]  (hidden comment: R0603-100K)
R16  value 100k  [RES_CHIP_0603]  (hidden comment: R0603-100K)
R17  value 1k  [RES_CHIP_0603]  (hidden comment: R0603-1K)
R18  value 120  [RES_CHIP_0603]  (hidden comment: R0603-120R)
R19  value 1k  [RES_CHIP_0603]  (hidden comment: R0603-1K)
R20  value 100k  [RES_CHIP_0603]  (hidden comment: R0603-100K)
R21  value 100k  [RES_CHIP_0603]  (hidden comment: R0603-100K)
R22  value 1M  [RES_CHIP_0603]  (hidden comment: R0603-1M)
U9  PESD5V0L2BT  [SOT23]
U10  THVD1450D  [VSSOP8_3X3_0.65E]
U11  PSM712  [SOT23]
U12  PESD5V0L2BT  [SOT23]

### Sub-sheets
PD Controller Sink = PD Controller Sink.SchDoc: CC Sink (harness CC Sink), VOUT, VBUS

### Ports
CLK_IN (out), USB_DET (out), USB_US (in, harness USB_US), VUSB_IN, ~{CLK_EN} (in)

### Harnesses
USB_US: D_P, D_N
CC Sink: CC2, CC1

### Nets
3V3: R15.1 R16.1
GND: C28.1 C29.1 C30.1 C31.1 CN3.A1,_A12,_B1,_B12(GND) D6.1(K) Q2.2(S) Q3.2(S) R20.1 R21.1 R22.1 U9.3(COM) U10.5(G) U11.3(COM) U12.3(COM)
VCLK: C29.2 U10.8(V)
CLK_CN_N: CN3.A10(RX2-) CN3.B10(RX1-) L5.4 U11.2(ANODE)
CLK_CN_P: CN3.A11(RX2+) CN3.B11(RX1+) L5.1 U11.1(ANODE)
CLK_N: L5.3 R18.1 U10.7(B)
CLK_P: L5.2 R18.2 U10.6(A)
CLK_USB: R19.2 ; port CLK_IN
USB_CN_N: CN3.A7,_B7(D-) L4.1 U9.1(ANODE)
USB_CN_P: CN3.A6,_B6(D+) L4.4 U9.2(ANODE)
USB_US.D_N: L4.2 ; port USB_US.D_N
USB_US.D_P: L4.3 ; port USB_US.D_P
VBUS: C28.2 CN3.A4,_A9,_B4,_B9(VBUS) D6.2(A) R17.1 ; sheet PD Controller Sink/VBUS
VIN: port VUSB_IN, sheet PD Controller Sink/VOUT
NetC30_2: C30.2 C31.2 CN3.0(SH) R22.2
NetCN3_A5: CN3.A5(CC1) U12.1(ANODE) ; sheet PD Controller Sink/CC Sink.CC1
NetCN3_B5: CN3.B5(CC2) U12.2(ANODE) ; sheet PD Controller Sink/CC Sink.CC2
NetQ1_3: R21.2 U10.2(~{RE}) ; port ~{CLK_EN}
NetQ2_1: Q2.1(G) R17.2
NetQ2_3: Q2.3(D) Q3.1(G) R15.2
NetQ3_3: Q3.3(D) R16.2 ; port USB_DET
NetR19_1: R19.1 U10.1(RO)
NetR20_2: R20.2 U10.3(DE) U10.4(D)

Not connected (* = marked no-connect by the designer): CN3 A2(TX1+)* A3(TX1-)* A8(SBU1)* B2(TX2+)* B3(TX2-)* B8(SBU2)*

### Layout directives
differential pair; differential pair class RS485: CLK_CN_N, CLK_CN_P, CLK_N, CLK_P
differential pair; differential pair class USB: USB_CN_N, USB_CN_P, USB_US.D_N, USB_US.D_P

### Notes on the sheet
- FILE
- VARIANT
- DATE
- REVISION
- SHEET
- /
- PROJECT
- SIZE
- (in symbol CMP-930-0015-1) R; RE; DI

### Library data of the parts
C28 = CMP-611-0042-4: 0805 Multilayer Ceramic Capacitors MLCC; PartNumber: GRM21BR61H106KE43L; Pick&PlaceFootprint: C0805; Tolerance: 10%; Dielectric: X5R; Capacitor Type: Ceramic; Mount: SMD; LCSC Part N.: C440198; Case/Package: 0805; RoHS: Yes
C29 = CMP-611-0027-24: as C2 on sheet Clock Input; Capacitor Type: Ceramic; RoHS: Yes; Mount: SMD; LCSC Part N.: C14663; Case/Package: 0603
C30 = CMP-611-0027-24: as C26 on sheet USB Downstream; LCSC Part N.: C14663; Capacitor Type: Ceramic; Case/Package: 0603; RoHS: Yes; Mount: SMD
C31 = CMP-611-0022-7: as C27 on sheet USB Downstream; Capacitor Type: Ceramic; Mount: SMD; Case/Package: 0603; LCSC Part N.: C57112; RoHS: Yes
CN3 = CMP-340-0003-10: USB 3.1 5A 1 260℃ Surface Mount，Right Angle 24P Female -45℃~+85℃ Type-C SMD USB Connectors; pin to pad: S1>G1+G2+G3+G4+G5+G6; PartNumber: TYPEC-324G-BCP24; Current Rating: 5A; Mount: Surface Mount; LCSC Part N.: C920230; Orientation: Horizontal; Gender: Female
D6 = CMP-210-0002-1: as D5 on sheet USB Downstream; PartNumber: SMFJ28CA; Stand-off Voltage: 28V; Pick&PlaceFootprint: SOD-123; Mount: Surface Mount; LCSC Part N.: C5125651
L4 = CMP-600-0002-3: as L2 on sheet USB Downstream; LCSC Part N.: C80529; Voltage Rating: 50V
L5 = CMP-600-0007-1: as L3 on sheet USB Downstream; LCSC Part N.: C370248; Voltage Rating: 20V
Q2 Q3 = CMP-810-0002-2: 30V 5.7A 26.5mΩ@10V,5.7A 1.4W 1.5V@250uA 1 NChannel SOT-23-3L MOSFETs; Gate-Source Voltage (Vgs): 12V; Pick&PlaceFootprint: SOT-23; RDS(ON): 26.5mR; Switching Time: 34.5ns; LCSC Part N.: C20917; Drain-Source Voltage (Vds): 30V; Mount: Surface Mount; PartNumber: AO3400A; Power Dissipation: 1.4W; Drain Current (Id): 5.7A; Polarity: N Channel
R15 R16 R20 R21 = CMP-633-0000-28: as R12 on sheet System Power; LCSC Part N.: C25803; Mount: Surface Mount; Voltage Rating: 75V; Power Rating: 100mW; Case/Package: 0603; Tolerance: 1%
R17 R19 = CMP-633-0013-26: as R1 on sheet Clock Input; Voltage Rating: 75V; Case/Package: 0603; Tolerance: 1%; Mount: Surface Mount; LCSC Part N.: C21190; Power Rating: 100mW
R18 = CMP-633-0100-12: as R26 on sheet Power Input; Mount: Surface Mount; Tolerance: 1%; Voltage Rating: 75V; Case/Package: 0603; Power Rating: 100mW; LCSC Part N.: C22787
R22 = CMP-633-0066-20: as R14 on sheet USB Downstream; Mount: Surface Mount; Case/Package: 0603; Voltage Rating: 75V; LCSC Part N.: C22935; Power Rating: 100mW; Tolerance: 1%
U9 U12 = CMP-210-0005-2: as U6 on sheet USB Downstream; PartNumber: PESD5V0L2BT; LCSC Part N.: C2858724
U10 = CMP-930-0015-1: 3.3-V to 5-V RS-485 transceiver with ±18-kV IEC ESD protection 8-VSSOP -40 to 125; PartNumber: THVD1450DGKR; Simplex/Duplex: Half Duplex; Data Rate: 50Mbps; Max Supply Voltage: 5V; Min Supply Voltage: 3.3V; LCSC Part N.: C2860896
U11 = CMP-210-0000-4: as U7 on sheet USB Downstream; LCSC Part N.: C32677; Stand-off Voltage: 12V; Pick&PlaceFootprint: SOT-23; Breakdown Voltage: 13.3V; Clamp Voltage: 19V; Mount: Surface Mount

## Sheet PD Controller Sink.SchDoc
size 297 x 209 mm; CompanyName: Sainsbury Wellcome Centre; Organization: FabLab; Address1: Sainsbury Wellcome Centre; Address2: 25 Howland Street; Address3: London; Address4: W1T 4JG; DocumentNumber: 5; SheetNumber: 5; SheetTotal: 14; swcgroup: FabLab; Org: Sainsbury Wellcome Centre; Add1: 25 Howland Street; Add2: London; Add3: W1T 4JG; WebAddress: www.sainsburywellcome.org; SheetSize: A4; SheetName: PD Controller Sink
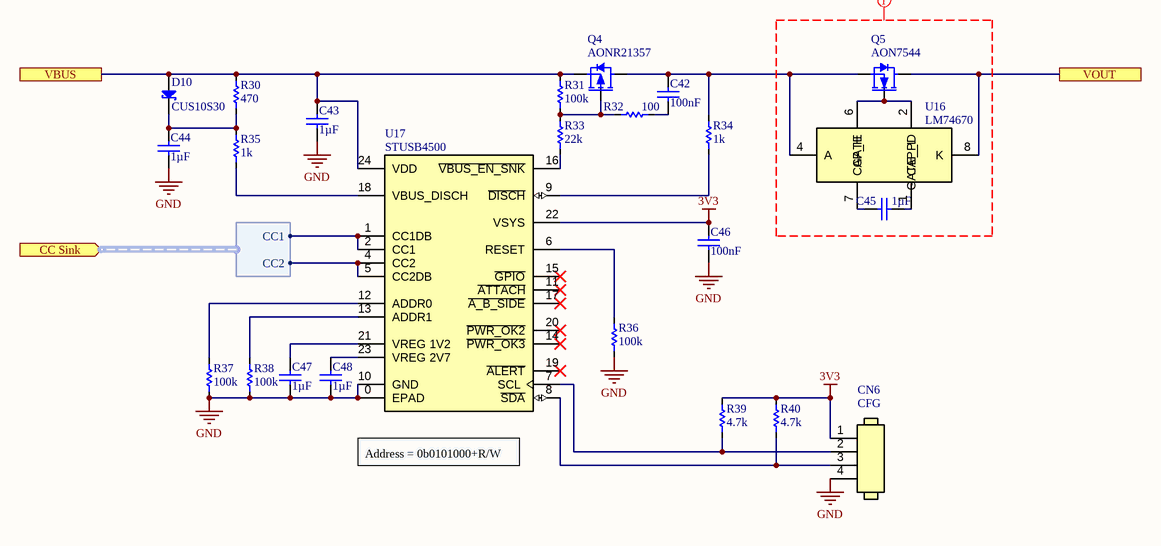
[diagram p7: PD Controller Sink.SchDoc]

### Parts
C42  value 100nF  [CAP_CHIP_0603]  (hidden comment: C0603-100nF-50V)
C43  value 1µF  [CAP_CHIP_0603]  (hidden comment: C0603-1uF-50V)
C44  value 1µF  [CAP_CHIP_0603]  (hidden comment: C0603-1uF-50V)
C45  value 1µF  [CAP_CHIP_0603]  (hidden comment: C0603-1uF-50V)
C46  value 100nF  [CAP_CHIP_0603]  (hidden comment: C0603-100nF-50V)
C47  value 1µF  [CAP_CHIP_0603]  (hidden comment: C0603-1uF-50V)
C48  value 1µF  [CAP_CHIP_0603]  (hidden comment: C0603-1uF-50V)
CN6  CFG  [MOLEX_1.25_4P]
D10  CUS10S30  [SOD323]
Q4  AONR21357  [DFN-8-MOS]
Q5  AON7544  [DFN-8-MOS]
R30  value 470  [RES_CHIP_0603]  (hidden comment: R0603-470R)
R31  value 100k  [RES_CHIP_0603]  (hidden comment: R0603-100K)
R32  value 100  [RES_CHIP_0603]  (hidden comment: R0603-100R)
R33  value 22k  [RES_CHIP_0603]  (hidden comment: R0603-22K)
R34  value 1k  [RES_CHIP_0603]  (hidden comment: R0603-1K)
R35  value 1k  [RES_CHIP_0603]  (hidden comment: R0603-1K)
R36  value 100k  [RES_CHIP_0603]  (hidden comment: R0603-100K)
R37  value 100k  [RES_CHIP_0603]  (hidden comment: R0603-100K)
R38  value 100k  [RES_CHIP_0603]  (hidden comment: R0603-100K)
R39  value 4.7k  [RES_CHIP_0603]  (hidden comment: R0603-4K7)
R40  value 4.7k  [RES_CHIP_0603]  (hidden comment: R0603-4K7)
U16  LM74670  [VSSOP8_3X3_0.65E]
U17  STUSB4500  [QFN24]

### Ports
CC Sink (in, harness CC Sink), VBUS, VOUT

### Harnesses
CC Sink: CC1, CC2

### Nets
3V3: C46.2 CN6.1 R39.2 R40.2 U17.22(VSYS)
GND: C43.1 C44.1 C46.1 C47.1 C48.1 CN6.4 R36.1 R37.1 R38.1 U17.0(EPAD) U17.10(GND)
VBUS: C43.2 D10.2(A) Q4.1,2,3(S) R30.2 R31.2 U17.24(VDD) ; port VBUS
VIN: Q5.5(D) U16.8(K) ; port VOUT
NetC42_1: C42.1 R32.2
NetC42_2: C42.2 Q4.5(D) Q5.1,2,3(S) R34.2 U16.4(A)
NetC44_2: C44.2 D10.1(C) R30.1 R35.2
NetC45_1: C45.1 U16.7(CAP_H)
NetC45_2: C45.2 U16.1(CAP_L)
NetC47_2: C47.2 U17.21(VREG_1V2)
NetC48_2: C48.2 U17.23(VREG_2V7)
NetCN3_A5: U17.1(CC1DB) U17.2(CC1) ; port CC Sink.CC1
NetCN3_B5: U17.4(CC2) U17.5(CC2DB) ; port CC Sink.CC2
NetCN6_2: CN6.2 R39.1 U17.7(SCL)
NetCN6_3: CN6.3 R40.1 U17.8(~{SDA})
NetQ4_4: Q4.4(G) R31.1 R32.1 R33.2
NetQ5_4: Q5.4(G) U16.2(GATE_PD) U16.6(GATE)
NetR33_1: R33.1 U17.16(~{VBUS_EN_SNK})
NetR34_1: R34.1 U17.9(~{DISCH})
NetR35_1: R35.1 U17.18(VBUS_DISCH)
NetR36_2: R36.2 U17.6(RESET)
NetR37_2: R37.2 U17.12(ADDR0)
NetR38_2: R38.2 U17.13(ADDR1)

Not connected (* = marked no-connect by the designer): U17 11(~{ATTACH})* 14(~{PWR_OK3})* 15(~{GPIO})* 17(~{A_B_SIDE})* 19(~{ALERT})* 20(~{PWR_OK2})*

### Layout directives
mark named Ideal Diode: (no net found under the mark)

### Notes on the sheet
- Address = 0b0101000+R/W
- FILE
- VARIANT
- DATE
- REVISION
- SHEET
- /
- PROJECT
- SIZE

### Library data of the parts
C42 C46 = CMP-611-0027-24: as C2 on sheet Clock Input; Capacitor Type: Ceramic; RoHS: Yes; Mount: SMD; LCSC Part N.: C14663; Case/Package: 0603
C43-C45 C47 C48 = CMP-611-0033-11: as C18 on sheet System Power; Case/Package: 0603; LCSC Part N.: C15849; RoHS: Yes; Mount: SMD; Capacitor Type: Ceramic
CN6 = CMP-370-0030-7: Conn Shrouded Header (3 Sides) HDR 4 POS 1.25mm Solder ST Top Entry SMD PicoBlade™ T/R; PartNumber: 53398-0471; Current Rating: 1A; Number of Positions: 4; Gender: Male; LCSC Part N.: C17617036; Orientation: Vertical; Number of Rows: 1; Pitch: 1.25mm; Mounting Technology: Surface Mount
D10 = CMP-821-0013-3: as D4 on sheet System Power; LCSC Part N.: C146335; Max Reverse Voltage: 30V; Mount: Surface Mount; Pick&PlaceFootprint: SOD323; Forward Current: 1A
Q4 = CMP-810-0004-1: 30V 30A 7.8mΩ@10V,20A 2.3V@250uA 1 PChannel DFN-8 MOSFETs; Drain-Source Voltage (Vds): -30V; RDS(ON): 8mR; Gate-Source Voltage (Vgs): 25V; Power Dissipation: 30W; Switching Time: 200ns; Drain Current (Id): -34A; Polarity: P Channel; Mount: Surface Mount; Pick&PlaceFootprint: DFN-8; PartNumber: AONR21357; LCSC Part N.: C431196
Q5 = CMP-810-0005-1: 30V 30A 5mΩ@10V,20A 2.2V@250uA 1 NChannel DFN-8 MOSFETs; Switching Time: 34.5ns; RDS(ON): 5mR; Power Dissipation: 1.4W; Gate-Source Voltage (Vgs): 20V; Mount: Surface Mount; Drain-Source Voltage (Vds): 30V; Drain Current (Id): 30A; LCSC Part N.: C315567; Pick&PlaceFootprint: DFN-8; Polarity: N Channel; PartNumber: AON7544
R30 = CMP-633-0020-24: 100mW Thick Film Resistors 75V ±100ppm/℃ ±1% 0603 Chip Resistor; PartNumber: 0603WAF4700T5E; Number of Resistors: 1; Pick&PlaceFootprint: R0603; LCSC Part N.: C23179; Case/Package: 0603; Power Rating: 100mW; Mount: Surface Mount; Voltage Rating: 75V; Tolerance: 1%
R31 R36-R38 = CMP-633-0000-28: as R12 on sheet System Power; LCSC Part N.: C25803; Mount: Surface Mount; Voltage Rating: 75V; Power Rating: 100mW; Case/Package: 0603; Tolerance: 1%
R32 = CMP-633-0094-12: 100mW Thick Film Resistors 75V ±100ppm/℃ ±1% 0603 Chip Resistor; PartNumber: 0603WAF1000T5E; Number of Resistors: 1; Pick&PlaceFootprint: R0603; Case/Package: 0603; Voltage Rating: 75V; Mount: Surface Mount; Tolerance: 1%; LCSC Part N.: C22775; Power Rating: 100mW
R33 = CMP-633-0099-12: 100mW Thick Film Resistors 75V ±100ppm/℃ ±1% 0603 Chip Resistor; PartNumber: 0603WAF2202T5E; Pick&PlaceFootprint: R0603; Number of Resistors: 1; LCSC Part N.: C31850; Mount: Surface Mount; Case/Package: 0603; Voltage Rating: 75V; Power Rating: 100mW; Tolerance: 1%
R34 R35 = CMP-633-0013-26: as R1 on sheet Clock Input; Voltage Rating: 75V; Case/Package: 0603; Tolerance: 1%; Mount: Surface Mount; LCSC Part N.: C21190; Power Rating: 100mW
R39 R40 = CMP-633-0024-26: 100mW Thick Film Resistors 75V ±100ppm/℃ ±1% 0603 Chip Resistor; PartNumber: 0603WAF4701T5E; Pick&PlaceFootprint: R0603; Number of Resistors: 1; Case/Package: 0603; Voltage Rating: 75V; Tolerance: 1%; Power Rating: 100mW; LCSC Part N.: C23162; Mount: Surface Mount
U16 = CMP-970-0064-2: OR Controller N-Channel Single Automotive 8-Pin VSSOP T/R; PartNumber: LM74670QDGKTQ1; Max Supply Voltage: 42V; Min Supply Voltage: 550mV; LCSC Part N.: C2653685
U17 = CMP-970-0029-9: Power Supply Support Circuit; PartNumber: STUSB4500QTR; LCSC Part N.: C2678061; Pick&PlaceFootprint: QFN24

## Sheet USB HUB.SchDoc
size 297 x 209 mm; CompanyName: Sainsbury Wellcome Centre; Organization: FabLab; Address1: Sainsbury Wellcome Centre; Address2: 25 Howland Street; Address3: London; Address4: W1T 4JG; DocumentNumber: 6; SheetNumber: 6; SheetTotal: 14; swcgroup: FabLab; Org: Sainsbury Wellcome Centre; Add1: 25 Howland Street; Add2: London; Add3: W1T 4JG; WebAddress: www.sainsburywellcome.org; SheetSize: A4; SheetName: USB HUB
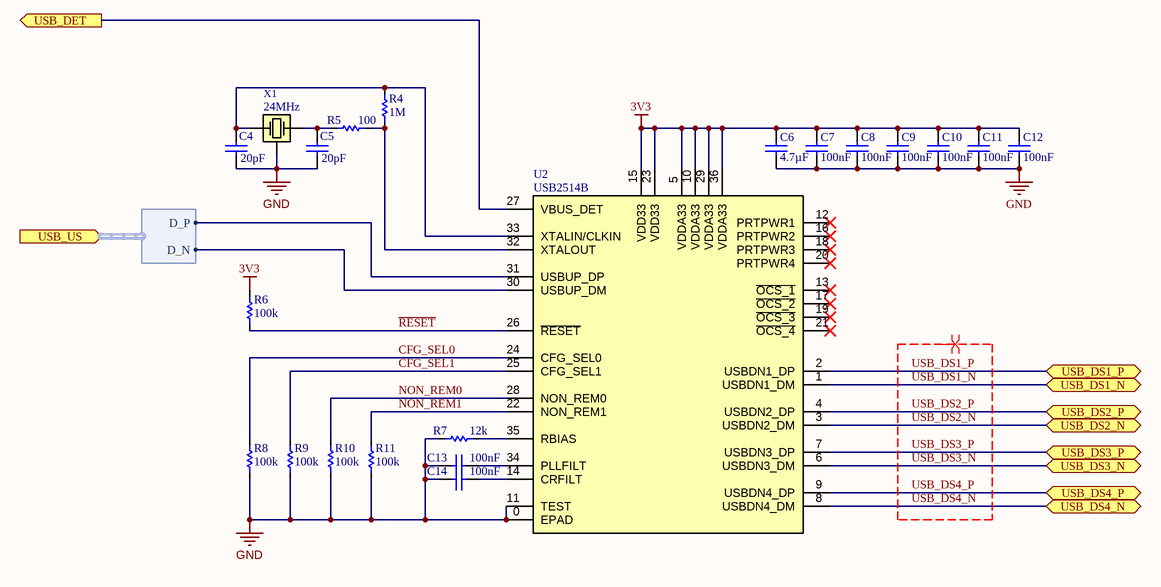
[diagram p8: USB HUB.SchDoc]

### Parts
C4  value 20pF  [CAP_CHIP_0603]  (hidden comment: C0603-20pF-50V)
C5  value 20pF  [CAP_CHIP_0603]  (hidden comment: C0603-20pF-50V)
C6  value 4.7µF  [CAP_CHIP_0603]  (hidden comment: C0603-4.7uF-16V)
C7  value 100nF  [CAP_CHIP_0603]  (hidden comment: C0603-100nF-50V)
C8  value 100nF  [CAP_CHIP_0603]  (hidden comment: C0603-100nF-50V)
C9  value 100nF  [CAP_CHIP_0603]  (hidden comment: C0603-100nF-50V)
C10  value 100nF  [CAP_CHIP_0603]  (hidden comment: C0603-100nF-50V)
C11  value 100nF  [CAP_CHIP_0603]  (hidden comment: C0603-100nF-50V)
C12  value 100nF  [CAP_CHIP_0603]  (hidden comment: C0603-100nF-50V)
C13  value 100nF  [CAP_CHIP_0603]  (hidden comment: C0603-100nF-50V)
C14  value 100nF  [CAP_CHIP_0603]  (hidden comment: C0603-100nF-50V)
R4  value 1M  [RES_CHIP_0603]  (hidden comment: R0603-1M)
R5  value 100  [RES_CHIP_0603]  (hidden comment: R0603-100R)
R6  value 100k  [RES_CHIP_0603]  (hidden comment: R0603-100K)
R7  value 12k  [RES_CHIP_0603]  (hidden comment: R0603-12K)
R8  value 100k  [RES_CHIP_0603]  (hidden comment: R0603-100K)
R9  value 100k  [RES_CHIP_0603]  (hidden comment: R0603-100K)
R10  value 100k  [RES_CHIP_0603]  (hidden comment: R0603-100K)
R11  value 100k  [RES_CHIP_0603]  (hidden comment: R0603-100K)
U2  USB2514B  [QFN36]
X1  Frequency: 24MHz  [OSC_SMD_2520]  (hidden comment: OSC2520-24M)

### Ports
USB_DET (out), USB_DS1_N (bidir), USB_DS1_P (bidir), USB_DS2_N (bidir), USB_DS2_P (bidir), USB_DS3_N (bidir), USB_DS3_P (bidir), USB_DS4_N (bidir), USB_DS4_P (bidir), USB_US (in, harness USB_US)

### Harnesses
USB_US: D_P, D_N

### Nets
3V3: C6.2 C7.2 C8.2 C9.2 C10.2 C11.2 C12.2 R6.1 U2.5(VDDA33) U2.10(VDDA33) U2.15(VDD33) U2.23(VDD33) U2.29(VDDA33) U2.36(VDDA33)
GND: C4.1 C5.1 C6.1 C7.1 C8.1 C9.1 C10.1 C11.1 C12.1 C13.2 C14.2 R7.1 R8.2 R9.2 R10.2 R11.2 U2.0(EPAD) U2.11(TEST) X1.2,4(GND)
CFG_SEL0: R8.1 U2.24(CFG_SEL0)
CFG_SEL1: R9.1 U2.25(CFG_SEL1)
NON_REM0: R10.1 U2.28(NON_REM0)
NON_REM1: R11.1 U2.22(NON_REM1)
~{RESET}: R6.2 U2.26(~{RESET})
USB_DS1_N: U2.1(USBDN1_DM) ; port USB_DS1_N
USB_DS1_P: U2.2(USBDN1_DP) ; port USB_DS1_P
USB_DS2_N: U2.3(USBDN2_DM) ; port USB_DS2_N
USB_DS2_P: U2.4(USBDN2_DP) ; port USB_DS2_P
USB_DS3_N: U2.6(USBDN3_DM) ; port USB_DS3_N
USB_DS3_P: U2.7(USBDN3_DP) ; port USB_DS3_P
USB_DS4_N: U2.8(USBDN4_DM) ; port USB_DS4_N
USB_DS4_P: U2.9(USBDN4_DP) ; port USB_DS4_P
USB_US.D_N: U2.30(USBUP_DM) ; port USB_US.D_N
USB_US.D_P: U2.31(USBUP_DP) ; port USB_US.D_P
NetC4_2: C4.2 R4.1 U2.33(XTALIN/CLKIN) X1.1
NetC5_2: C5.2 R5.1 X1.3
NetC13_1: C13.1 U2.34(PLLFILT)
NetC14_1: C14.1 U2.14(CRFILT)
NetQ3_3: U2.27(VBUS_DET) ; port USB_DET
NetR4_2: R4.2 R5.2 U2.32(XTALOUT)
NetR7_2: R7.2 U2.35(RBIAS)

Not connected (* = marked no-connect by the designer): U2 12(PRTPWR1)* 13(~{OCS_1})* 16(PRTPWR2)* 17(~{OCS_2})* 18(PRTPWR3)* 19(~{OCS_3})* 20(PRTPWR4)* 21(~{OCS_4})*

### Layout directives
differential pair; differential pair class USB: USB_DS1_N, USB_DS1_P, USB_DS2_N, USB_DS2_P, USB_DS3_N, USB_DS3_P, USB_DS4_N, USB_DS4_P

### Notes on the sheet
- FILE
- VARIANT
- DATE
- REVISION
- SHEET
- /
- PROJECT
- SIZE

### Library data of the parts
C4 C5 = CMP-611-0064-3: 0603 Multilayer Ceramic Capacitors MLCC; PartNumber: CL10C200JB8NNNC; Dielectric: C0G; Tolerance: 5%; Voltage Rating: 50V; Pick&PlaceFootprint: C0603; Capacitor Type: Ceramic; RoHS: Yes; LCSC Part N.: C1648; Case/Package: 0603; Mount: SMD
C6 = CMP-611-0056-4: 0603 Multilayer Ceramic Capacitors MLCC; PartNumber: CL10A475KO8NNNC; Tolerance: 10%; Voltage Rating: 16V; Dielectric: X5R; Pick&PlaceFootprint: C0603; LCSC Part N.: C19666; RoHS: Yes; Mount: SMD; Case/Package: 0603; Capacitor Type: Ceramic
C7-C14 = CMP-611-0027-24: as C26 on sheet USB Downstream; LCSC Part N.: C14663; Capacitor Type: Ceramic; Case/Package: 0603; RoHS: Yes; Mount: SMD
R4 = CMP-633-0066-20: as R23 on sheet Power Input; Voltage Rating: 75V; Mount: Surface Mount; LCSC Part N.: C22935; Power Rating: 100mW; Tolerance: 1%; Case/Package: 0603
R5 = CMP-633-0094-12: as R32 on sheet PD Controller Sink; Case/Package: 0603; Voltage Rating: 75V; Mount: Surface Mount; Tolerance: 1%; LCSC Part N.: C22775; Power Rating: 100mW
R6 R8-R11 = CMP-633-0000-28: as R12 on sheet System Power; Case/Package: 0603; Tolerance: 1%; Voltage Rating: 75V; LCSC Part N.: C25803; Power Rating: 100mW; Mount: Surface Mount
R7 = CMP-633-0106-3: 100mW Thick Film Resistors 75V ±100ppm/℃ ±1% 0603 Chip Resistor; PartNumber: 0603WAF1202T5E; Pick&PlaceFootprint: R0603; Number of Resistors: 1; Voltage Rating: 75V; Power Rating: 100mW; Tolerance: 1%; Mount: Surface Mount; Case/Package: 0603; LCSC Part N.: C22790
U2 = CMP-930-0006-5: USB251xB Series 3.6 V Surface Mount USB 2.0 Hi-Speed Hub Controller - QFN-36; PartNumber: USB2514B-AEZC-TR; Number of Ports: 4; Operating Supply Voltage: 3.3V; Data Rate: 480Mbps; LCSC Part N.: C16251; Pick&PlaceFootprint: QFN36
X1 = CMP-400-0005-2: SMD XTL MHZ +/-10PPM, +/-15PPM-30-85C 12.0PF 250T/R; pin to pad: 2>2+4; PartNumber: Q24FA20H00153; Load Capatitance: 12pF; Type: Passive; Mount: SMD; LCSC Part N.: C255951

## Sheet USB PD Controller.SchDoc
size 297 x 209 mm; CompanyName: Sainsbury Wellcome Centre; Organization: FabLab; Address1: Sainsbury Wellcome Centre; Address2: 25 Howland Street; Address3: London; Address4: W1T 4JG; DocumentNumber: 7; SheetNumber: 7; SheetTotal: 14; swcgroup: FabLab; Org: Sainsbury Wellcome Centre; Add1: 25 Howland Street; Add2: London; Add3: W1T 4JG; WebAddress: www.sainsburywellcome.org; SheetSize: A4; SheetName: USB PD Controller
Used 4 times, as channels USB PD Controller0, USB PD Controller1, USB PD Controller2, USB PD Controller3. Parts and nets are listed once, with the designators drawn on the sheet.
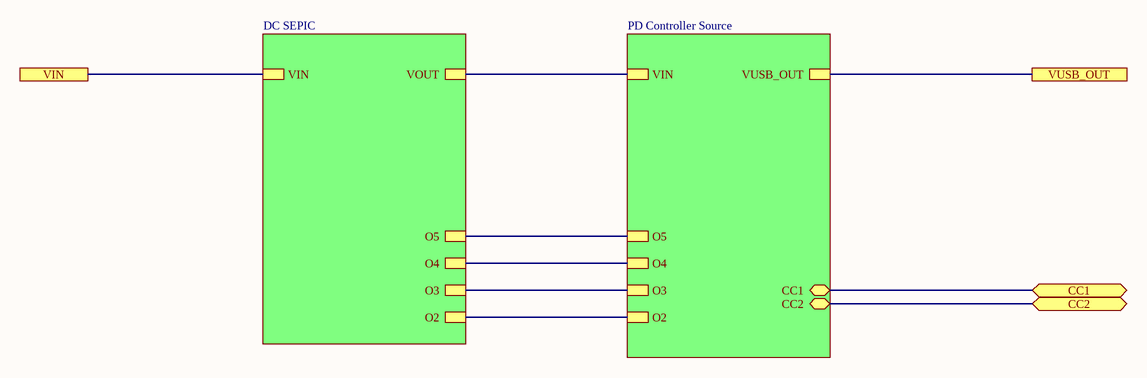
[diagram p9: USB PD Controller.SchDoc]

### Sub-sheets
DC SEPIC = DC SEPIC.SchDoc: VIN, VOUT, O5, O4, O3, O2
PD Controller Source = PD Controller Source.SchDoc: VIN, CC1 (bidir), CC2 (bidir), VUSB_OUT, O5, O4, O3, O2

### Ports
CC1 (bidir), CC2 (bidir), VIN, VUSB_OUT

### Nets
CC1: port CC1, sheet PD Controller Source/CC1
CC2: port CC2, sheet PD Controller Source/CC2
VIN: port VIN, sheet DC SEPIC/VIN
VUSB_OUT: port VUSB_OUT, sheet PD Controller Source/VUSB_OUT
(unnamed): sheet DC SEPIC/VOUT, sheet PD Controller Source/VIN
(unnamed): sheet DC SEPIC/O5, sheet PD Controller Source/O5
(unnamed): sheet DC SEPIC/O4, sheet PD Controller Source/O4
(unnamed): sheet DC SEPIC/O3, sheet PD Controller Source/O3
(unnamed): sheet DC SEPIC/O2, sheet PD Controller Source/O2

### Channels
USB PD Controller0: ports CC1=CC10 CC2=CC20 VIN=VIN VUSB_OUT=VUSB_OUT0
USB PD Controller1: ports CC1=CC11 CC2=CC21 VIN=VIN VUSB_OUT=VUSB_OUT1
USB PD Controller2: ports CC1=CC12 CC2=CC22 VIN=VIN VUSB_OUT=VUSB_OUT2
USB PD Controller3: ports CC1=CC13 CC2=CC23 VIN=VIN VUSB_OUT=VUSB_OUT3

### Notes on the sheet
- FILE
- VARIANT
- DATE
- REVISION
- SHEET
- /
- PROJECT
- SIZE